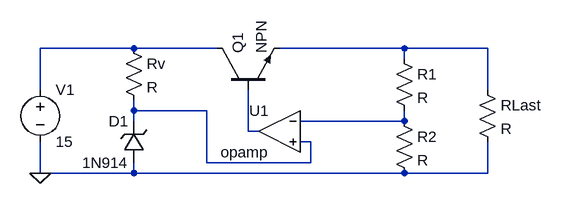
[diagram p0: schematic Spannungsstabilisierung_Zmugg.asc]
Spannungsstabilisierung_Zmugg.asc, the LTspice schematic file:
Version 4.1
SHEET 1 880 680
WIRE 96 80 -48 80
WIRE 224 80 96 80
WIRE 512 80 320 80
WIRE 640 80 512 80
WIRE 512 96 512 80
WIRE -48 144 -48 80
WIRE 640 144 640 80
WIRE 96 176 96 160
WIRE 208 176 96 176
WIRE 96 192 96 176
WIRE 512 192 512 176
WIRE 512 192 352 192
WIRE 272 208 272 144
WIRE 288 208 272 208
WIRE 368 224 352 224
WIRE 208 256 208 176
WIRE 368 256 368 224
WIRE 368 256 208 256
WIRE -48 272 -48 224
WIRE 96 272 96 256
WIRE 96 272 -48 272
WIRE 512 272 96 272
WIRE 640 272 640 224
WIRE 640 272 512 272
FLAG -48 272 0
SYMBOL res 80 64 R0
SYMATTR InstName Rv
SYMBOL zener 112 256 R180
WINDOW 0 24 64 Left 2
WINDOW 3 24 0 Left 2
SYMATTR InstName D1
SYMATTR Value 1N914
SYMBOL npn 224 144 R270
SYMATTR InstName Q1
SYMBOL OpAmps\\opamp 320 144 M0
SYMATTR InstName U1
SYMBOL res 496 80 R0
SYMATTR InstName R1
SYMBOL res 496 176 R0
SYMATTR InstName R2
SYMBOL voltage -48 128 R0
WINDOW 123 0 0 Left 0
WINDOW 39 0 0 Left 0
SYMATTR InstName V1
SYMATTR Value 15
SYMBOL res 624 128 R0
SYMATTR InstName RLast

The netlist it stands for:
* Spannungsstabilisierung_Zmugg.asc
Rv N001 N003 R
D1 0 N003 1N914
Q1 N001 N005 N002 0 NPN
X§U1 N004 N003 N005 opamp Aol=100K GBW=10Meg  ; pins invin noninvin out
R1 N002 N004 R
R2 N004 0 R
V1 N001 0 15
RLast N002 0 R
.model D D
.lib standard.dio
.model NPN NPN
.model PNP PNP
.lib standard.bjt
.backanno
.end